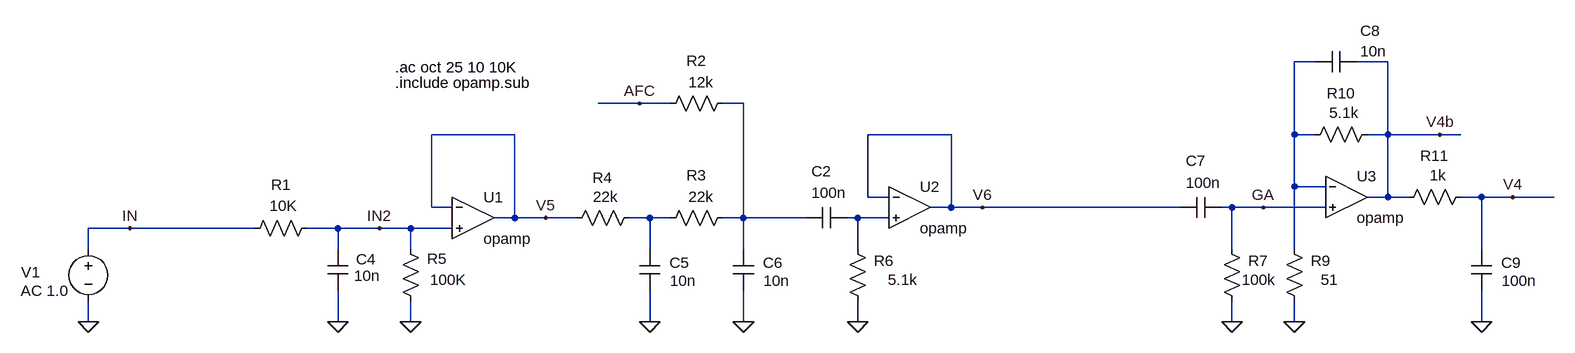
[diagram p0: schematic opamp.asc]
opamp.asc, the LTspice schematic file:
Version 4.1
SHEET 1 5945676 13421556
WIRE 2784 -160 2752 -160
WIRE 2896 -160 2848 -160
WIRE 1744 -96 1680 -96
WIRE 1792 -96 1744 -96
WIRE 1904 -96 1872 -96
WIRE 1552 -48 1424 -48
WIRE 2224 -48 2096 -48
WIRE 2752 -48 2752 -160
WIRE 2784 -48 2752 -48
WIRE 2896 -48 2896 -160
WIRE 2896 -48 2864 -48
WIRE 2976 -48 2896 -48
WIRE 3008 -48 2976 -48
WIRE 2752 32 2752 -48
WIRE 2800 32 2752 32
WIRE 2096 48 2096 -48
WIRE 2128 48 2096 48
WIRE 2896 48 2896 -48
WIRE 2896 48 2864 48
WIRE 2928 48 2896 48
WIRE 3040 48 3008 48
WIRE 3088 48 3040 48
WIRE 3152 48 3088 48
WIRE 1424 64 1424 -48
WIRE 1456 64 1424 64
WIRE 2224 64 2224 -48
WIRE 2224 64 2192 64
WIRE 2272 64 2224 64
WIRE 2576 64 2272 64
WIRE 2656 64 2640 64
WIRE 2704 64 2656 64
WIRE 2800 64 2704 64
WIRE 1552 80 1552 -48
WIRE 1552 80 1520 80
WIRE 1600 80 1552 80
WIRE 1648 80 1600 80
WIRE 1760 80 1728 80
WIRE 1792 80 1760 80
WIRE 1904 80 1904 -96
WIRE 1904 80 1872 80
WIRE 2000 80 1904 80
WIRE 2080 80 2064 80
WIRE 2128 80 2080 80
WIRE 960 96 896 96
WIRE 1152 96 960 96
WIRE 1280 96 1232 96
WIRE 1344 96 1280 96
WIRE 1392 96 1344 96
WIRE 1456 96 1392 96
WIRE 896 128 896 96
WIRE 1280 128 1280 96
WIRE 1392 128 1392 96
WIRE 1760 128 1760 80
WIRE 1904 128 1904 80
WIRE 2080 128 2080 80
WIRE 2656 128 2656 64
WIRE 2752 128 2752 32
WIRE 3040 128 3040 48
WIRE 896 240 896 208
WIRE 1280 240 1280 192
WIRE 1392 240 1392 208
WIRE 1760 240 1760 192
WIRE 1904 240 1904 192
WIRE 2080 240 2080 208
WIRE 2656 240 2656 208
WIRE 2752 240 2752 208
WIRE 3040 240 3040 192
FLAG 896 240 0
FLAG 2272 64 V6
FLAG 1600 80 V5
FLAG 1280 240 0
FLAG 1760 240 0
FLAG 1904 240 0
FLAG 2080 240 0
FLAG 1392 240 0
FLAG 1744 -96 AFC
FLAG 960 96 IN
FLAG 1344 96 IN2
FLAG 2656 240 0
FLAG 2704 64 GA
FLAG 2752 240 0
FLAG 3088 48 V4
FLAG 3040 240 0
FLAG 2976 -48 V4b
SYMBOL voltage 896 112 R0
WINDOW 0 -103 52 Left 2
WINDOW 3 -104 52 Left 2
WINDOW 123 -104 80 Left 2
WINDOW 39 0 0 Left 0
SYMATTR InstName V1
SYMATTR Value ""
SYMATTR Value2 AC 1.0
SYMBOL res 1248 80 R90
WINDOW 0 -35 55 VBottom 2
WINDOW 3 -34 52 VTop 2
SYMATTR InstName R1
SYMATTR Value 10K
SYMBOL res 1744 64 R90
WINDOW 0 -30 57 VBottom 2
WINDOW 3 -32 52 VTop 2
SYMATTR InstName R4
SYMATTR Value 22k
SYMBOL res 2096 224 R180
WINDOW 0 -40 78 Left 2
WINDOW 3 -76 49 Left 2
SYMATTR InstName R6
SYMATTR Value 5.1k
SYMBOL OPAMPS\\OPAMP 1488 16 R0
SYMATTR InstName U1
SYMATTR SpiceLine2 GBW=3Meg
SYMBOL OPAMPS\\OPAMP 2160 0 R0
SYMATTR InstName U2
SYMATTR SpiceLine2 GBW=3Meg
SYMBOL res 1888 64 R90
WINDOW 0 -34 56 VBottom 2
WINDOW 3 -32 49 VTop 2
SYMATTR InstName R3
SYMATTR Value 22k
SYMBOL cap 2064 64 R90
WINDOW 0 -40 40 VBottom 2
WINDOW 3 -38 28 VTop 2
SYMATTR InstName C2
SYMATTR Value 100n
SYMBOL cap 1264 192 M180
WINDOW 0 44 48 Left 2
WINDOW 3 41 23 Left 2
SYMATTR InstName C4
SYMATTR Value 10n
SYMBOL cap 1744 192 M180
WINDOW 0 46 43 Left 2
WINDOW 3 47 15 Left 2
SYMATTR InstName C5
SYMATTR Value 10n
SYMBOL cap 1888 192 M180
WINDOW 0 46 43 Left 2
WINDOW 3 47 15 Left 2
SYMATTR InstName C6
SYMATTR Value 10n
SYMBOL res 1408 224 R180
WINDOW 0 -40 81 Left 2
WINDOW 3 -70 49 Left 2
SYMATTR InstName R5
SYMATTR Value 100K
SYMBOL cap 2640 48 R90
WINDOW 0 -40 40 VBottom 2
WINDOW 3 -38 28 VTop 2
SYMATTR InstName C7
SYMATTR Value 100n
SYMBOL res 2672 224 R180
WINDOW 0 -40 78 Left 2
WINDOW 3 -52 49 Left 2
SYMATTR InstName R7
SYMATTR Value 100k
SYMBOL OPAMPS\\OPAMP 2832 -16 R0
SYMATTR InstName U3
SYMATTR SpiceLine2 GBW=3Meg
SYMBOL res 2768 224 R180
WINDOW 0 -40 78 Left 2
WINDOW 3 -52 49 Left 2
SYMATTR InstName R9
SYMATTR Value 51
SYMBOL res 2880 -64 R90
WINDOW 0 -32 56 VBottom 2
WINDOW 3 -33 51 VTop 2
SYMATTR InstName R10
SYMATTR Value 5.1k
SYMBOL cap 2848 -176 R90
WINDOW 0 -16 -21 VBottom 2
WINDOW 3 -16 -26 VTop 2
SYMATTR InstName C8
SYMATTR Value 10n
SYMBOL res 3024 32 R90
WINDOW 0 -32 56 VBottom 2
WINDOW 3 -33 51 VTop 2
SYMATTR InstName R11
SYMATTR Value 1k
SYMBOL cap 3024 192 M180
WINDOW 0 46 43 Left 2
WINDOW 3 47 15 Left 2
SYMATTR InstName C9
SYMATTR Value 100n
SYMBOL res 1888 -112 R90
WINDOW 0 -34 56 VBottom 2
WINDOW 3 -32 49 VTop 2
SYMATTR InstName R2
SYMATTR Value 12k
TEXT 1368 -152 Left 2 !.ac oct 25 10 10K
TEXT 1368 -128 Left 2 !.include opamp.sub

The netlist it stands for:
* opamp.asc
V1 IN 0 AC 1.0
R1 IN2 IN 10K
R4 N003 V5 22k
R6 0 N004 5.1k
X§U1 V5 IN2 V5 opamp Aol=100K GBW=3Meg  ; pins invin noninvin out
X§U2 V6 N004 V6 opamp Aol=100K GBW=3Meg  ; pins invin noninvin out
R3 N002 N003 22k
C2 N004 N002 100n
C4 0 IN2 10n
C5 0 N003 10n
C6 0 N002 10n
R5 0 IN2 100K
C7 GA V6 100n
R7 0 GA 100k
X§U3 N001 GA V4b opamp Aol=100K GBW=3Meg  ; pins invin noninvin out
R9 0 N001 51
R10 V4b N001 5.1k
C8 V4b N001 10n
R11 V4 V4b 1k
C9 0 V4 100n
R2 N002 AFC 12k
.ac oct 25 10 10K
.include opamp.sub
.backanno
.end